# Altium project LTC2949_TestBoard.PrjPcb
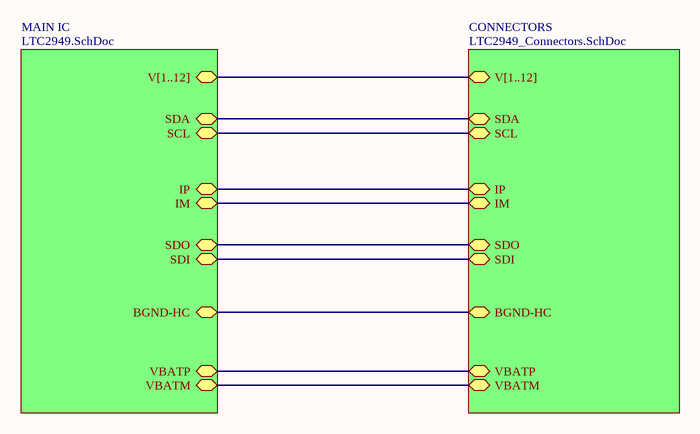
[diagram p0: TopLevel.SchDoc]
3 sheets, 42 parts. Net scope: hierarchical (ports join the sheet entries above them; power ports are global).
Board file: PCB1-LTC2949-V1.PcbDoc
Sheets:
  TopLevel.SchDoc
    MAIN IC = LTC2949.SchDoc
    CONNECTORS = LTC2949_Connectors.SchDoc

## Sheet TopLevel.SchDoc: LTC2949 Top Level
size A4; Author: Leo Xie & Naveela Sookoo; Organization: Waterloop; Address1: 200 University Avenue W; Address2: Engineering 5, 1104; Address3: Waterloo, Ontario; Address4: N2L 3G1; DocumentNumber: 1; Revision: 1; SheetNumber: 1; SheetTotal: 3

### Sub-sheets
CONNECTORS = LTC2949_Connectors.SchDoc: V[1..12] (bidir), SDA (bidir), SCL (bidir), VBATP (bidir), VBATM (bidir), BGND-HC (bidir), IP (bidir), IM (bidir), SDO (bidir), SDI (bidir)
MAIN IC = LTC2949.SchDoc: V[1..12] (bidir), SDA (bidir), SCL (bidir), VBATP (bidir), VBATM (bidir), BGND-HC (bidir), IP (bidir), IM (bidir), SDO (bidir), SDI (bidir)

### Nets
AGND: sheet MAIN IC/VBATM, sheet CONNECTORS/VBATM
VBATP: sheet MAIN IC/VBATP, sheet CONNECTORS/VBATP
NetP1_3: sheet MAIN IC/SDO, sheet CONNECTORS/SDO
NetP1_4: sheet MAIN IC/SDI, sheet CONNECTORS/SDI
NetP2_2: sheet MAIN IC/SDA, sheet CONNECTORS/SDA
NetP2_3: sheet MAIN IC/SCL, sheet CONNECTORS/SCL
NetP3_1: sheet MAIN IC/IP, sheet CONNECTORS/IP
NetP3_2: sheet MAIN IC/IM, sheet CONNECTORS/IM
NetP7_2: sheet MAIN IC/BGND-HC, sheet CONNECTORS/BGND-HC

### Buses and harness runs
bus sheet CONNECTORS/V[1..12] = sheet MAIN IC/V[1..12]

### Notes on the sheet
- Title:
- Size:
- Date:
- A4
- Author:
- Revision:
- Sheet
- of
- File:

## Sheet LTC2949.SchDoc: LTC2949 Test Board
size A4; Author: Leo Xie & Naveela Sookoo; Organization: Waterloop; Address1: 200 University Avenue W; Address2: Engineering 5 ,1104; Address3: Waterloo, Ontario; Address4: N2L 3G1; DocumentNumber: 2; Revision: 1; SheetNumber: 2; SheetTotal: 3
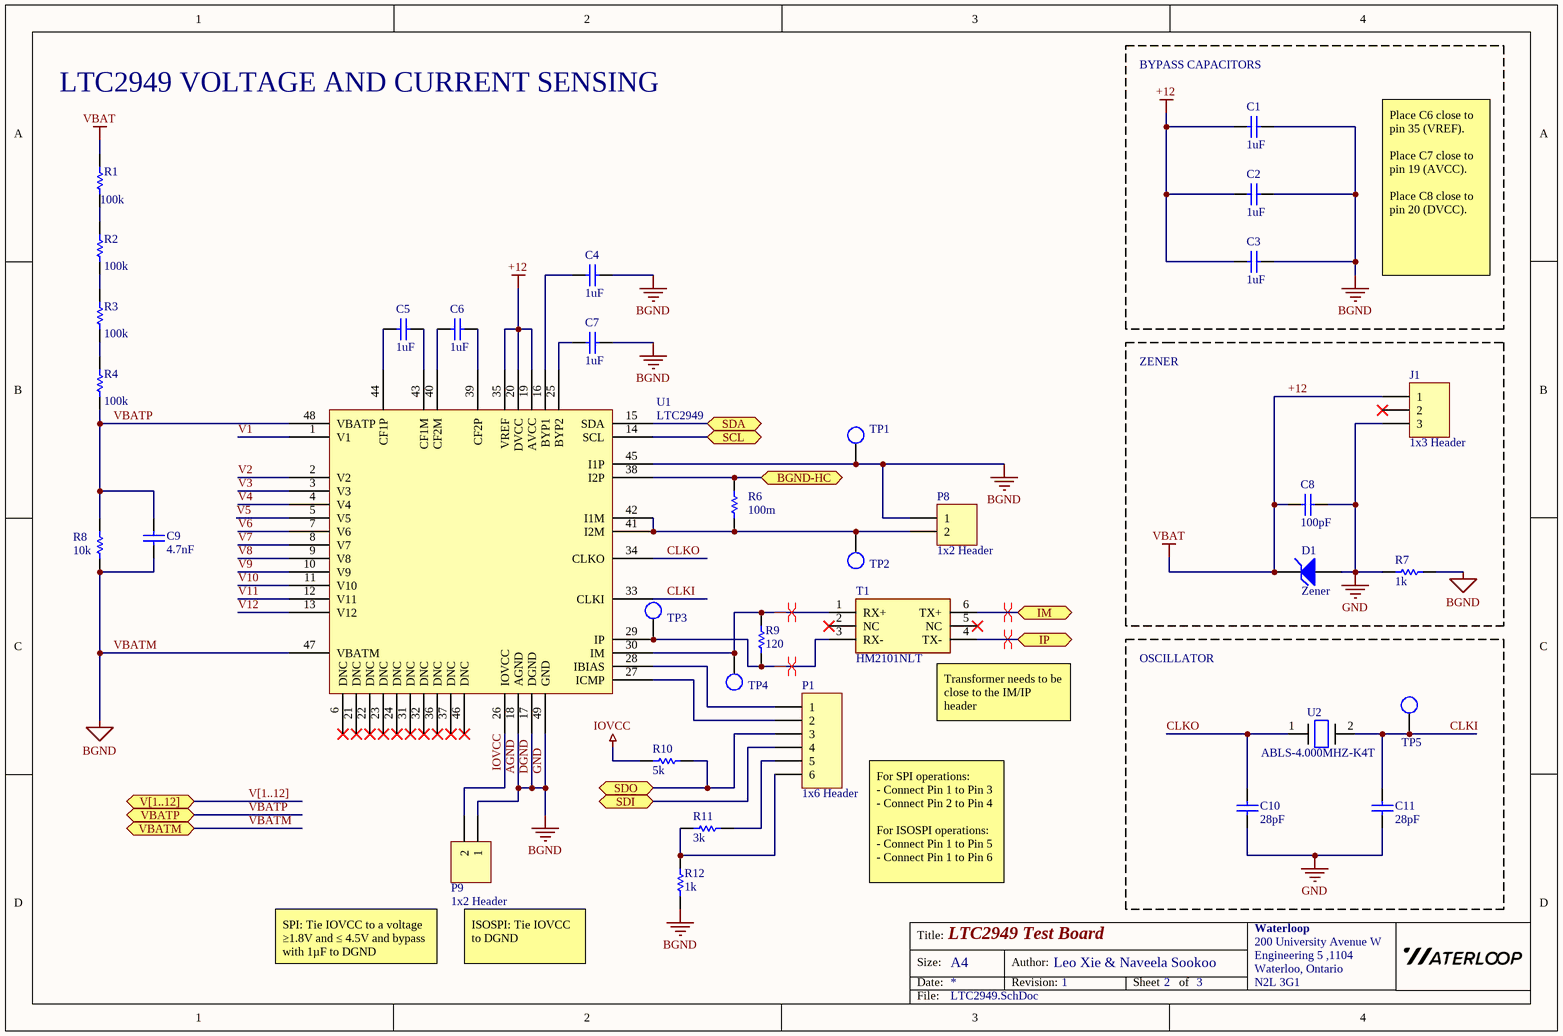
[diagram p1: LTC2949.SchDoc]

### Parts
C1  value 1uF  [0805 - Capacitor]  (hidden comment: Nonpolarized Capacitor)
C2  value 1uF  [0805 - Capacitor]  (hidden comment: Nonpolarized Capacitor)
C3  value 1uF  [0805 - Capacitor]  (hidden comment: Nonpolarized Capacitor)
C4  value 1uF  [0805 - Capacitor]  (hidden comment: Nonpolarized Capacitor)
C5  value 1uF  [0805 - Capacitor]  (hidden comment: Nonpolarized Capacitor)
C6  value 1uF  [0805 - Capacitor]  (hidden comment: Nonpolarized Capacitor)
C7  value 1uF  [0805 - Capacitor]  (hidden comment: Nonpolarized Capacitor)
C8  value 100pF  [0805 - Capacitor]  (hidden comment: Nonpolarized Capacitor)
C9  value 4.7nF  [0805 - Capacitor]  (hidden comment: Nonpolarized Capacitor)
C10  value 28pF  [0805 - Capacitor]  (hidden comment: Nonpolarized Capacitor)
C11  value 28pF  [0805 - Capacitor]  (hidden comment: Nonpolarized Capacitor)
D1  Zener  [SMA - DIODE]
J1  1x3 Header  [HDR1X3]
P1  1x6 Header  [HDR1X6]
P8  1x2 Header  [HDR1X2]
P9  1x2 Header  [HDR1X2]
R1  value 100k  [1206 - Resistor]  (hidden comment: Resistor)
R2  value 100k  [1206 - Resistor]  (hidden comment: Resistor)
R3  value 100k  [1206 - Resistor]  (hidden comment: Resistor)
R4  value 100k  [1206 - Resistor]  (hidden comment: Resistor)
R6  value 100m  [0603 - Resistor]  (hidden comment: Resistor)
R7  value 1k  [0603 - Resistor]  (hidden comment: Resistor)
R8  value 10k  [0805 - Resistor]  (hidden comment: Resistor)
R9  value 120  [0603 - Resistor]  (hidden comment: Resistor)
R10  value 5k  [0603 - Resistor]  (hidden comment: Resistor)
R11  value 3k  [0603 - Resistor]  (hidden comment: Resistor)
R12  value 1k  [0603 - Resistor]  (hidden comment: Resistor)
T1  HM2101NLT  [HM2101NLT]
TP1  Test Point  [Test Point]  (value not drawn)  (no BOM)
TP2  Test Point  [Test Point]  (value not drawn)  (no BOM)
TP3  Test Point  [Test Point]  (value not drawn)  (no BOM)
TP4  Test Point  [Test Point]  (value not drawn)  (no BOM)
TP5  Test Point  [Test Point]  (value not drawn)  (no BOM)
U1  LTC2949  [LTC2949]
U2  ABLS-4.000MHZ-K4T  [ABLS_4MHZ-K4T]

### Blocks framed on the sheet
BYPASS CAPACITORS: C1-C3
ZENER: C8 D1 J1 R7
OSCILLATOR: C10 C11 TP5 U2

### Ports
BGND-HC (bidir), IM (bidir), IP (bidir), SCL (bidir), SDA (bidir), SDI (bidir), SDO (bidir), V[1..12] (bidir), VBATM (bidir), VBATP (bidir)

### Nets
+12: C1.1 C2.1 C3.1 C8.1 D1.2(K) J1.1 R1.2 U1.19(AVCC) U1.20(DVCC) U1.35(VREF)  [also labelled VBAT]
AGND: C1.2 C2.2 C3.2 C4.2 C7.2 C8.2 C9.1 C10.1 C11.1 D1.1(A) J1.3 P8.1 P9.1 R7.1 R7.2 R8.1 R12.2 TP1.1 U1.17(DGND) U1.18(AGND) U1.45(I1P) U1.47(VBATM) U1.49(GND) ; port VBATM  [also labelled BGND, DGND, GND, VBATM]
IOVCC: P9.2 R10.1 U1.26(IOVCC)
CLKI: C11.2 TP5.1 U1.33(CLKI) U2.2
CLKO: C10.2 U1.34(CLKO) U2.1
V1: U1.1(V1)
V2: U1.2(V2)
V3: U1.3(V3)
V4: U1.4(V4)
V5: U1.5(V5)
V6: U1.7(V6)
V7: U1.8(V7)
V8: U1.9(V8)
V9: U1.10(V9)
V10: U1.11(V10)
V11: U1.12(V11)
V12: U1.13(V12)
VBATP: C9.2 R4.1 R8.2 U1.48(VBATP) ; port VBATP
NetC4_1: C4.1 U1.16(BYP1)
NetC5_1: C5.1 U1.44(CF1P)
NetC5_2: C5.2 U1.43(CF1M)
NetC6_1: C6.1 U1.40(CF2M)
NetC6_2: C6.2 U1.39(CF2P)
NetC7_1: C7.1 U1.25(BYP2)
NetP1_1: P1.1 U1.28(IBIAS)
NetP1_2: P1.2 U1.27(ICMP)
NetP1_3: P1.3 R10.2 ; port SDO
NetP1_4: P1.4 ; port SDI
NetP1_5: P1.5 R11.2
NetP1_6: P1.6 R11.1 R12.1
NetP2_2: U1.15(SDA) ; port SDA
NetP2_3: U1.14(SCL) ; port SCL
NetP3_1: T1.4(TX-) ; port IP
NetP3_2: T1.6(TX+) ; port IM
NetP7_2: R6.2 U1.38(I2P) ; port BGND-HC
NetP8_2: P8.2 R6.1 TP2.1 U1.41(I2M) U1.42(I1M)
NetR1_1: R1.1 R2.2
NetR2_1: R2.1 R3.2
NetR3_1: R3.1 R4.2
NetR9_1: R9.1 T1.3(RX-) TP3.1 U1.29(IP)
NetR9_2: R9.2 T1.1(RX+) TP4.1 U1.30(IM)

Not connected (* = marked no-connect by the designer): J1 2*; T1 2(NC)* 5(NC)*; U1 6(DNC)* 21(DNC)* 22(DNC)* 23(DNC)* 24(DNC)* 31(DNC)* 32(DNC)* 36(DNC)* 37(DNC)* 46(DNC)*

### Buses and harness runs
bus V[1..12] = port V[1..12]

### Layout directives
differential pair: NetP3_1, NetP3_2, NetR9_1, NetR9_2

### Notes on the sheet
- LTC2949 VOLTAGE AND CURRENT SENSING
- Place C6 close to pin 35 (VREF).
  Place C7 close to pin 19 (AVCC).
  Place C8 close to pin 20 (DVCC).
- (near T1) Transformer needs to be close to the IM/IP header
- For SPI operations:
  - Connect Pin 1 to Pin 3
  - Connect Pin 2 to Pin 4
  For ISOSPI operations:
  - Connect Pin 1 to Pin 5
  - Connect Pin 1 to Pin 6
- SPI: Tie IOVCC to a voltage ≥1.8V and ≤ 4.5V and bypass with 1µF to DGND
- ISOSPI: Tie IOVCC to DGND
- Title:
- Size:
- Date:
- A4
- Author:
- Revision:
- Sheet
- of
- File:

### Library data of the parts
C1-C11 = Capacitor - Nonpolarized: Supplier Part Number: *; Supplier: *; Manufacturer: *; Rating: *; Manufacturer Part Number: *
D1 = Zener: Zener Diode; Manufacturer Part Number: *; Manufacturer: *; Supplier: *; Supplier Part Number: *; Value: *
J1 = 1x3 Header: 1x3 Pin Header
P1 = 1x6 Header: 1x6 Pin Header
P8 P9 = 1x2 Header: 1x2 Pin Header
T1 = HM2101NLT: Pulse Transformer 1:1 Surface Mount 150µH, 450µH
U1 = LTC2949: Manufacturer: Analog Devices; Manufacturer Part Number: LTC2949ILXE#3ZZPBF; Supplier: Mouser; Supplier Part Number: 584-2949ILXE3ZZPBF
U2 = ABLS-4.000MHZ-K4T: Crystal Oscillator 4MHz 18pF
R1-R4 R6-R12 = Resistor: Rating: *; Manufacturer Part Number: *; Manufacturer: *; Supplier Part Number: *; Supplier: *

## Sheet LTC2949_Connectors.SchDoc: LTC2949 Connectors
size A4; Author: Leo Xie & Naveela Sookoo; Organization: Waterloop; Address1: 200 University Avenue W; Address2: Engineering 5, 1104; Address3: Waterloo, Ontario; Address4: N2L 3G1; DocumentNumber: 3; Revision: 1; SheetNumber: 3; SheetTotal: 3
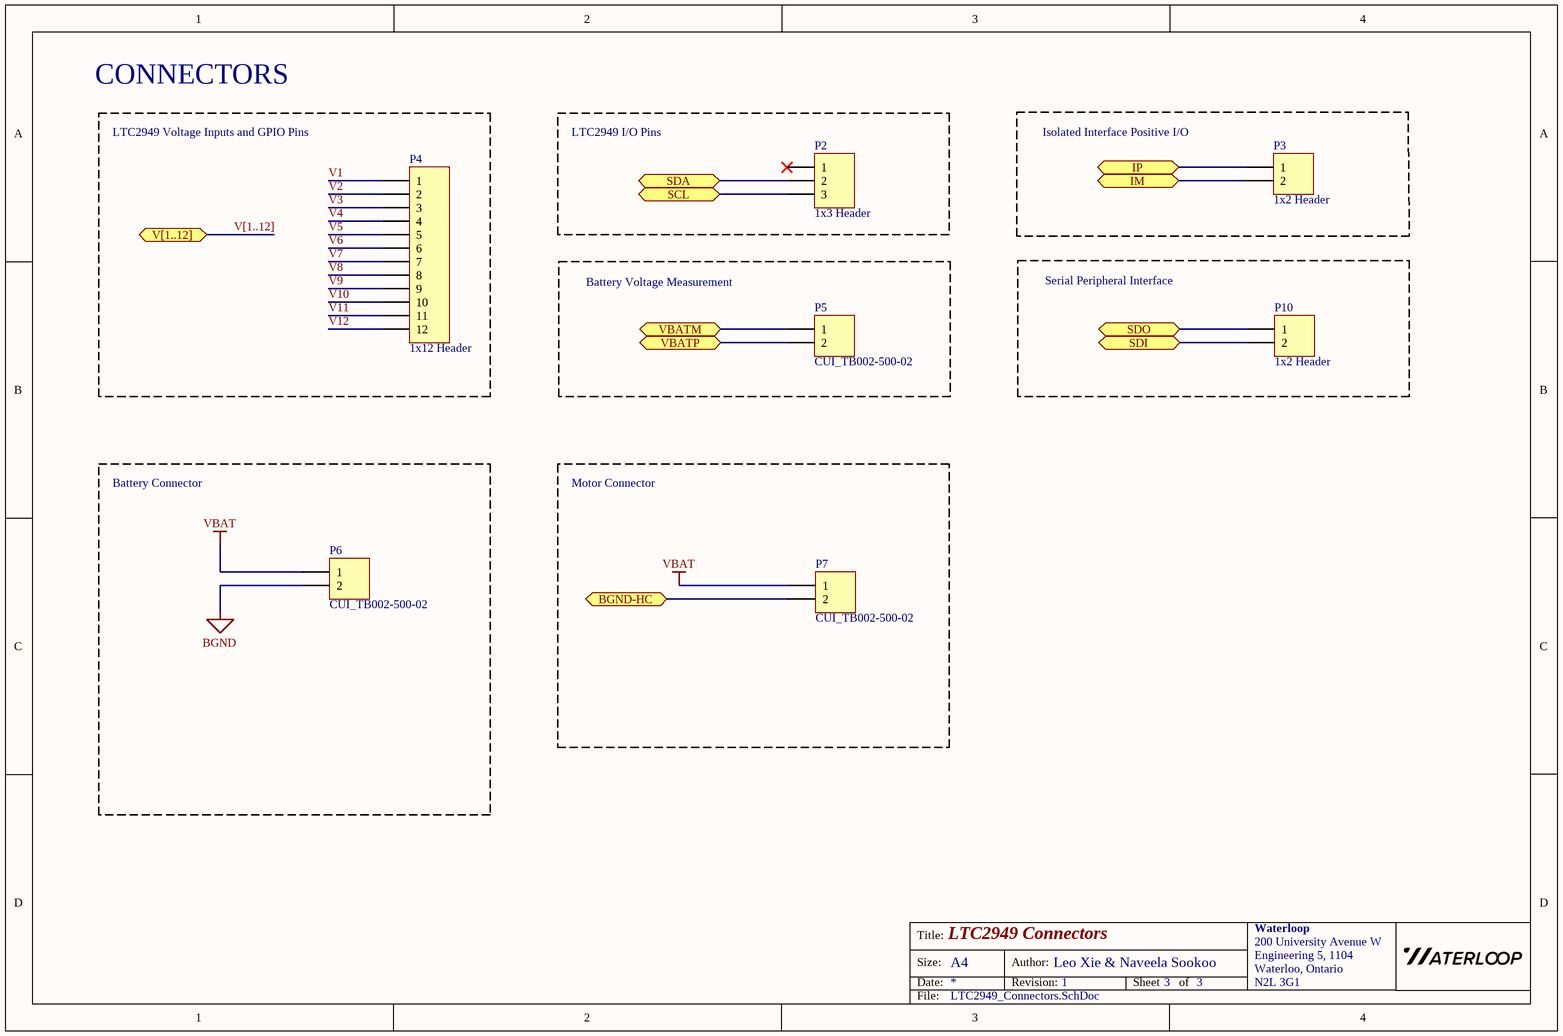
[diagram p2: LTC2949_Connectors.SchDoc]

### Parts
P2  1x3 Header  [HDR1X3]
P3  1x2 Header  [HDR1X2]
P4  1x12 Header  [HDR1X12]
P5  CUI_TB002-500-02  [CUI_TB002-500-02]
P6  CUI_TB002-500-02  [CUI_TB002-500-02]
P7  CUI_TB002-500-02  [CUI_TB002-500-02]
P10  1x2 Header  [HDR1X2]

### Blocks framed on the sheet
LTC2949 Voltage Inputs and GPIO Pins: P4
LTC2949 I/O Pins: P2
Isolated Interface Positive I/O: P3
Battery Voltage Measurement: P5
Serial Peripheral Interface: P10
Battery Connector: P6
Motor Connector: P7

### Ports
BGND-HC (bidir), IM (bidir), IP (bidir), SCL (bidir), SDA (bidir), SDI (bidir), SDO (bidir), V[1..12] (bidir), VBATM (bidir), VBATP (bidir)

### Nets
BGND: P5.1 P6.2 ; port VBATM  [project net AGND]
VBAT: P6.1 P7.1  [project net +12]
V1: P4.1
V2: P4.2
V3: P4.3
V4: P4.4
V5: P4.5
V6: P4.6
V7: P4.7
V8: P4.8
V9: P4.9
V10: P4.10
V11: P4.11
V12: P4.12
VBATP: P5.2 ; port VBATP
NetP1_3: P10.1 ; port SDO
NetP1_4: P10.2 ; port SDI
NetP2_2: P2.2 ; port SDA
NetP2_3: P2.3 ; port SCL
NetP3_1: P3.1 ; port IP
NetP3_2: P3.2 ; port IM
NetP7_2: P7.2 ; port BGND-HC

Not connected (* = marked no-connect by the designer): P2 1*

### Buses and harness runs
bus V[1..12] = port V[1..12]

### Notes on the sheet
- CONNECTORS
- Title:
- Size:
- Date:
- A4
- Author:
- Revision:
- Sheet
- of
- File:

### Library data of the parts
P2 = 1x3 Header: 1x3 Pin Header
P3 P10 = 1x2 Header: 1x2 Pin Header
P4 = 1x12 Header: 1x12 Pin Header
P5-P7 = CUI_TB002-500-02: 1x2 Screw Terminal Block; Manufacturer: CUI Devices; Manufacturer Part Number: TB002-500-02BE; Supplier: Digikey; Supplier Part Number: 102-6145-ND

## Nets that join several sheets
+12: LTC2949 (10 pins), LTC2949_Connectors (P6.1 P7.1)
AGND: LTC2949 (23 pins), LTC2949_Connectors (P5.1 P6.2)
NetP1_3: LTC2949 (P1.3 R10.2), LTC2949_Connectors (P10.1)
NetP1_4: LTC2949 (P1.4), LTC2949_Connectors (P10.2)
NetP2_2: LTC2949 (U1.15), LTC2949_Connectors (P2.2)
NetP2_3: LTC2949 (U1.14), LTC2949_Connectors (P2.3)
NetP3_1: LTC2949 (T1.4), LTC2949_Connectors (P3.1)
NetP3_2: LTC2949 (T1.6), LTC2949_Connectors (P3.2)
NetP7_2: LTC2949 (R6.2 U1.38), LTC2949_Connectors (P7.2)
V1: LTC2949 (U1.1), LTC2949_Connectors (P4.1)
V2: LTC2949 (U1.2), LTC2949_Connectors (P4.2)
V3: LTC2949 (U1.3), LTC2949_Connectors (P4.3)
V4: LTC2949 (U1.4), LTC2949_Connectors (P4.4)
V5: LTC2949 (U1.5), LTC2949_Connectors (P4.5)
V6: LTC2949 (U1.7), LTC2949_Connectors (P4.6)
V7: LTC2949 (U1.8), LTC2949_Connectors (P4.7)
V8: LTC2949 (U1.9), LTC2949_Connectors (P4.8)
V9: LTC2949 (U1.10), LTC2949_Connectors (P4.9)
V10: LTC2949 (U1.11), LTC2949_Connectors (P4.10)
V11: LTC2949 (U1.12), LTC2949_Connectors (P4.11)
V12: LTC2949 (U1.13), LTC2949_Connectors (P4.12)
VBATP: LTC2949 (C9.2 R4.1 R8.2 U1.48), LTC2949_Connectors (P5.2)